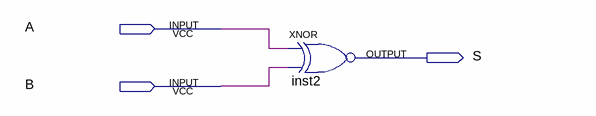
[diagram p0: schematic sheet]
// Quartus schematic Equal_Comparator.bdf as structural Verilog: 1 symbols, 3 pins
module Equal_Comparator (
  input  A,
  input  B,
  output S
);

  xnor inst2 (S, A, B);
endmodule
